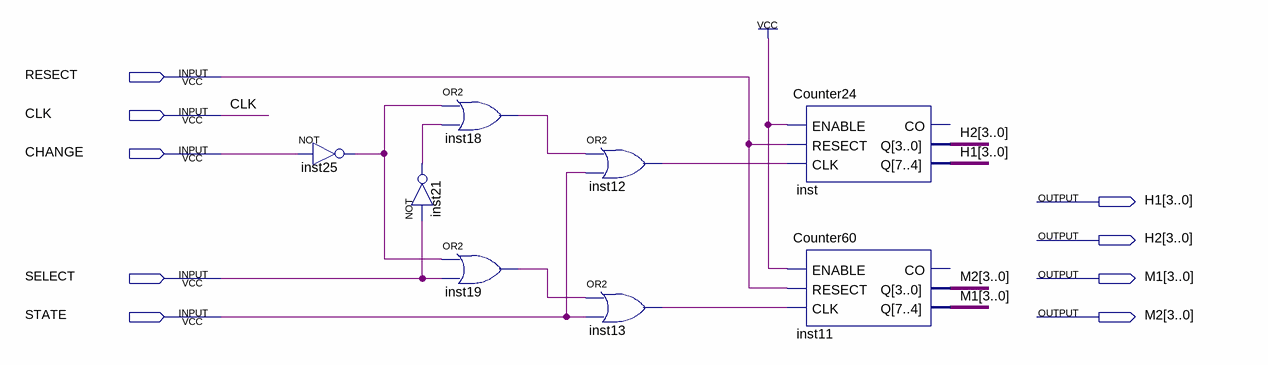
[diagram p0: schematic sheet]
// Quartus schematic AlarmModule.bdf as structural Verilog: 8 symbols, 9 pins
module AlarmModule (
  input  RESECT,
  input  CLK,
  input  CHANGE,
  input  SELECT,
  input  STATE,
  output [3:0] H1,
  output [3:0] H2,
  output [3:0] M1,
  output [3:0] M2
);

  wire inst12_out, inst13_out, inst18_out, inst19_out, inst21_out, inst25_out;

  not inst25 (inst25_out, CHANGE);
  not inst21 (inst21_out, SELECT);
  or inst18 (inst18_out, inst25_out, inst21_out);
  or inst19 (inst19_out, inst25_out, SELECT);
  or inst12 (inst12_out, inst18_out, STATE);
  or inst13 (inst13_out, inst19_out, STATE);
  Counter24 inst (.ENABLE(1'b1), .RESECT(RESECT), .CLK(inst12_out), .Q({H1, H2}));  // open: CO
  Counter60 inst11 (.ENABLE(1'b1), .RESECT(RESECT), .CLK(inst13_out), .Q({M1, M2}));  // open: CO
endmodule
